# EAGLE design transistorboard (EAGLE 9.6.1)
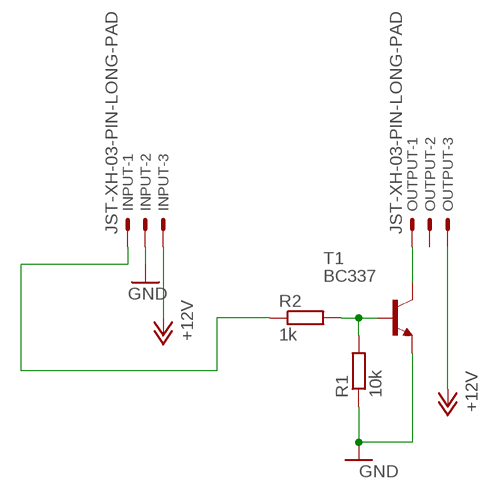
[diagram p0: schematic, sheet 1]

## Parts
INPUT  JST-XH-03-PIN-LONG-PAD  [JST-XH-03-PACKAGE-LONG-PAD]
OUTPUT  JST-XH-03-PIN-LONG-PAD  [JST-XH-03-PACKAGE-LONG-PAD]
R1  10k  R-EU_0204/7  [0204/7]
R2  1k  R-EU_0204/7  [0204/7]
T1  BC337  [TO92]

## Nets
+12V: INPUT.3 OUTPUT.3
GND: INPUT.2 R1.1 T1.1(E)
N$1: OUTPUT.1 T1.3(C)
N$3: INPUT.1 R2.1
N$4: R1.2 R2.2 T1.2(B)
Unconnected: OUTPUT.2

## Library data of the parts
INPUT OUTPUT = Rembrandt Electronics - JST XH Connectors v1-0:JST-XH-03-PIN: JST XH Connector 2 Pin Wire to board connector. Pitch: 2,54 mm, (0.100") Number of pins: 3 Created by Rembrandt Electronics www.rembrandtelectronics.com
R1 R2 = rcl:R-EU_: RESISTOR, European symbol; SPICEPREFIX: R
T1 = transistor:BC337: NPN TRANSISTOR

## Board
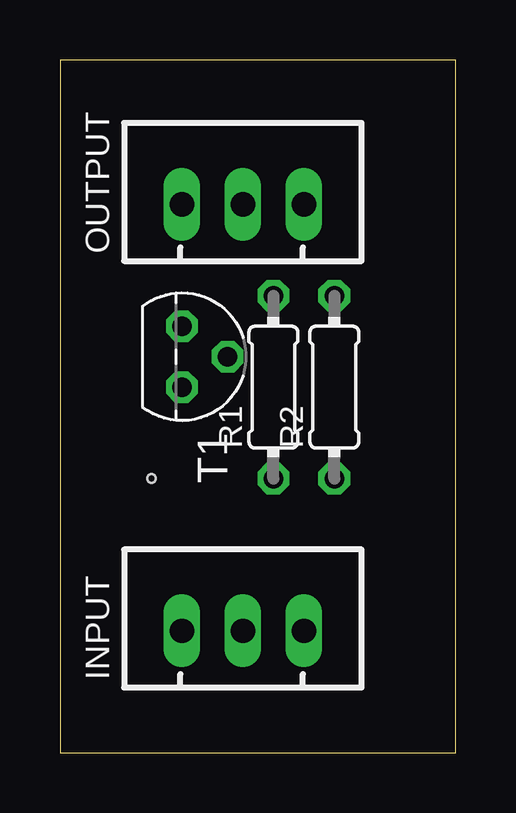
[diagram p1: board, top side]
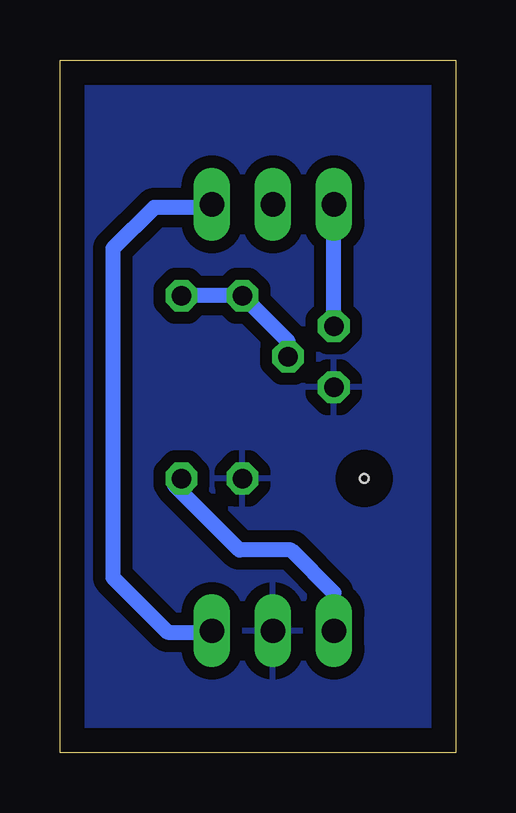
[diagram p2: board, bottom side, seen from below]

Size 16.49 x 28.88 mm. Coordinates in mm from the lower left corner, seen from the top.
Outline: 0,0 16.49,0 16.49,28.88 0,28.88 0,0
Copper layers (1*16): Top 0.035mm / dielectric 1.5mm / Bottom 0.035mm
Design rules "default2 *": minimum track width 25mil, minimum drill 0.35mm, track to track 20mil, track to pad 20mil, pad to pad 20mil, via to via 20mil, smd to smd 20mil, copper to edge 40mil, drill to drill 6mil, minimum pad ring 10mil, minimum via ring 8mil, stop-mask expansion 4mil, vias tented up to drill 0mil, thermal gap 20mil
Holes 0.35 mm at 3.81,11.43

### Footprints (pad centres in the part's own frame; a part is rotated, then mirrored left to right if it is on the bottom)
JST-XH-03-PACKAGE-LONG-PAD = drill 1.016 long: 1 -2.54,0; 2 0,0; 3 2.54,0
0204/7 = drill 0.813 octagon: 1 -3.81,0; 2 3.81,0
TO92 = drill 0.813 octagon: 1 1.27,0; 2 0,1.905; 3 -1.27,0

### Placement (x,y rotation side)
INPUT  7.62,5.08 0 top
OUTPUT  7.62,22.86 0 top
R1  8.89,15.24 90 top
R2  11.43,15.24 90 top
T1  5.08,16.51 270 top

### Tracks (layer width: path | path; a pad name or v marks a point on that pad's centre or on a via)
+12V
  Bottom 0.635: INPUT.3 10.29,5.02 12,5.02 14.29,7.3 14.29,21.02 12.57,22.73 10.29,22.73 OUTPUT.3
GND
  pour Bottom: 0,29.21 16.51,29.21 16.51,0 0,0
N$1
  Bottom 0.635: T1.3 OUTPUT.1
N$3
  Bottom 0.635: INPUT.1 5.08,6.67 6.86,8.45 9.02,8.45 11.72,11.14 R2.1
N$4
  Bottom 0.635: T1.2 6.99,17.14 R1.2 R2.2